# EAGLE design VisualEar-2.0 (EAGLE 9.6.2)
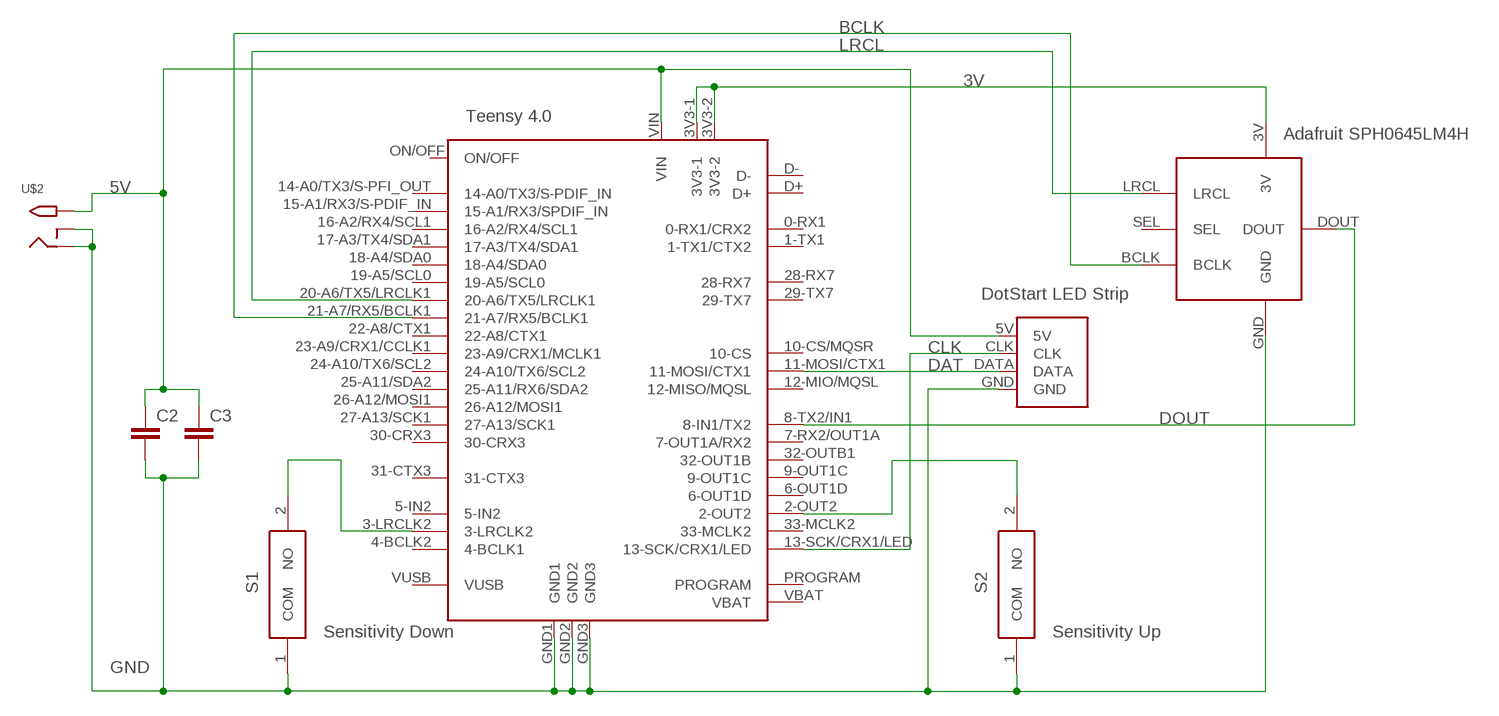
[diagram p0: schematic, sheet 1]

## Parts
C2  CAPPTH  [CAP-PTH-SMALL]
C3  CAPPTH  [CAP-PTH-SMALL]
S1  TACTILE-SWITCHTHRU-HOLE  [CLICK-WEL]
S2  TACTILE-SWITCHTHRU-HOLE  [CLICK-WEL]
U$1  TEENSY40DIP  [TEENSY40-DIP]
U$2  2.1MMJACKTHM  [PJ-102A]
U$3  AF-I2S-MIC  [AF-I2S-MIC]
U$4  LED-STRIP  [LED_STRIP]

## Nets
3V: U$1.3V3-1 U$1.3V3-2 U$3.3V
5V: C2.1 C3.1 U$1.VIN U$2.TIP U$4.5V
BCLK: U$1.21-A7/RX5/BCLK1 U$3.BCLK
CLK: U$1.13-SCK/CRX1/LED U$4.CLK
DAT: U$1.11-MOSI/CTX1 U$4.DATA
DOUT: U$1.8-TX2/IN1(8-IN1/TX2) U$3.DOUT
GND: C2.2 C3.2 S1.1(COM) S2.1(COM) U$1.GND1 U$1.GND2 U$1.GND3 U$2.RING U$2.RING_SW U$3.GND U$4.GND
LRCL: U$1.20-A6/TX5/LRCLK1 U$3.LRCL
N$1: S2.2(NO) U$1.2-OUT2
N$2: S1.2(NO) U$1.3-LRCLK2
Unconnected: U$1.0-RX1(0-RX1/CRX2) U$1.1-TX1(1-TX1/CTX2) U$1.4-BCLK2(4-BCLK1) U$1.5-IN2 U$1.6-OUT1D U$1.7-RX2/OUT1A(7-OUT1A/RX2) U$1.9-OUT1C U$1.10-CS/MQSR(10-CS) U$1.12-MIO/MQSL(12-MISO/MQSL) U$1.14-A0/TX3/S-PFI_OUT(14-A0/TX3/S-PDIF_IN) U$1.15-A1/RX3/S-PDIF_IN(15-A1/RX3/SPDIF_IN) U$1.16-A2/RX4/SCL1 U$1.17-A3/TX4/SDA1 U$1.18-A4/SDA0 U$1.19-A5/SCL0 U$1.22-A8/CTX1 U$1.23-A9/CRX1/CCLK1(23-A9/CRX1/MCLK1) U$1.24-A10/TX6/SCL2 U$1.25-A11/SDA2(25-A11/RX6/SDA2) U$1.26-A12/MOSI1 U$1.27-A13/SCK1 U$1.28-RX7 U$1.29-TX7 U$1.30-CRX3 U$1.31-CTX3 U$1.32-OUTB1(32-OUT1B) U$1.33-MCLK2 U$1.D+ U$1.D- U$1.ON/OFF U$1.PROGRAM U$1.VBAT U$1.VUSB U$3.SEL

## Notes on the sheet
- Teensy 4.0
- Adafruit SPH0645LM4H
- DotStart LED Strip
- Sensitivity Down | Sensitivity Up

## Library data of the parts
C2 C3 = philbot:CAP: Capacitor Standard 0603 ceramic capacitor, and 0.1" leaded capacitor.
S1 S2 = philbot:TACTILE-SWITCH: Tactile Switches Tact 50mA 12VDC, 6.0x3.5, 2.5mm H, 250gf, J leads, No ground pin, Red Actuator Source: Datasheet <https://www.mouser.com/datasheet/2/60/pts636-1550567.pdf>
U$1 = teensy:TEENSY40: Teensy 4.0 device including POGO pins for pins 24 - 33, but not yet pins for D+ and D-. Symbol layout is what works for me and may not suite everyone... that can be added or additional symbols can be created to be used in a modilied davie name.
U$2 = philbot:2.1MMJACK: 2.1mm x 5.5mm THM DC jack with internal switch. Digikey part #PJ-102A, 4UCON part #05537 2.1mm x 5.5mm SMT DC jack with internal switch. Digikey part #PJ-002A-SMT, 4UCON part #03267 By microbuilder.eu & adafruit.com
U$3 = philbot:AF-I2S-MIC
U$4 = philbot:LED-STRIP

## Board
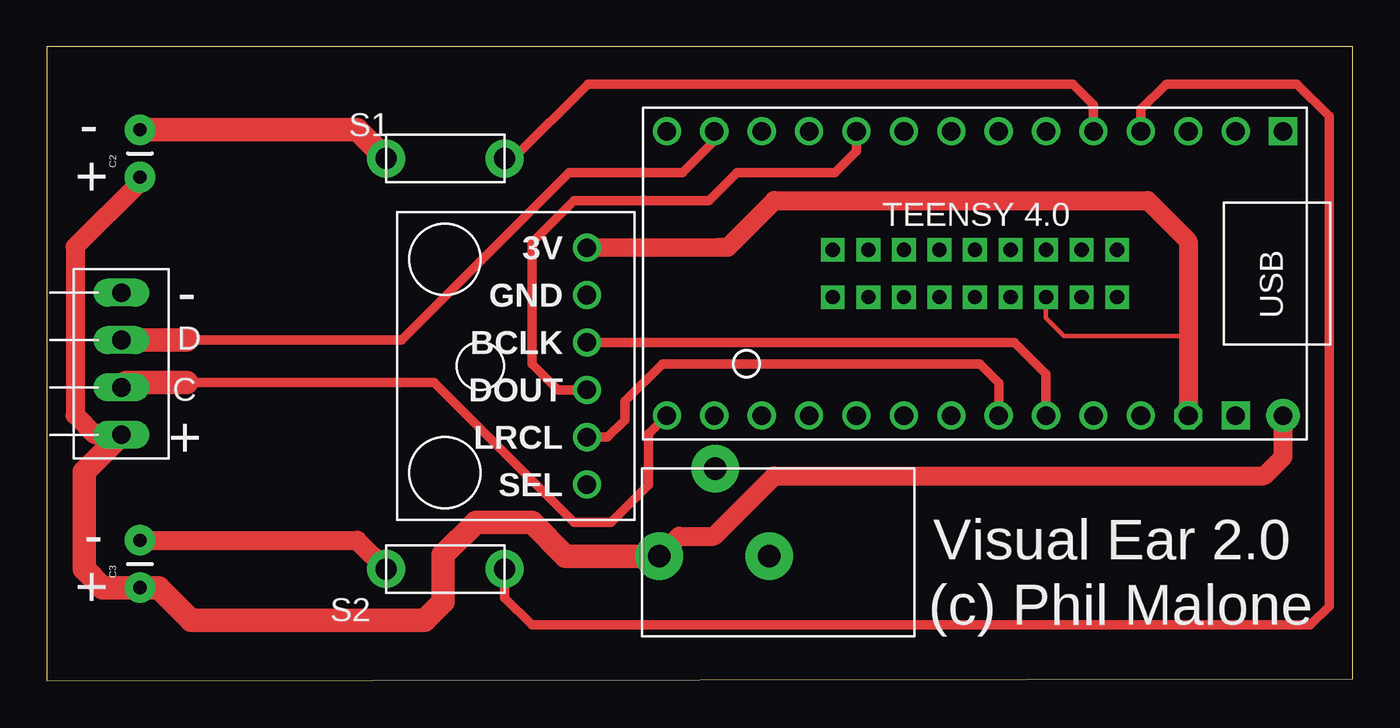
[diagram p1: board, top side]
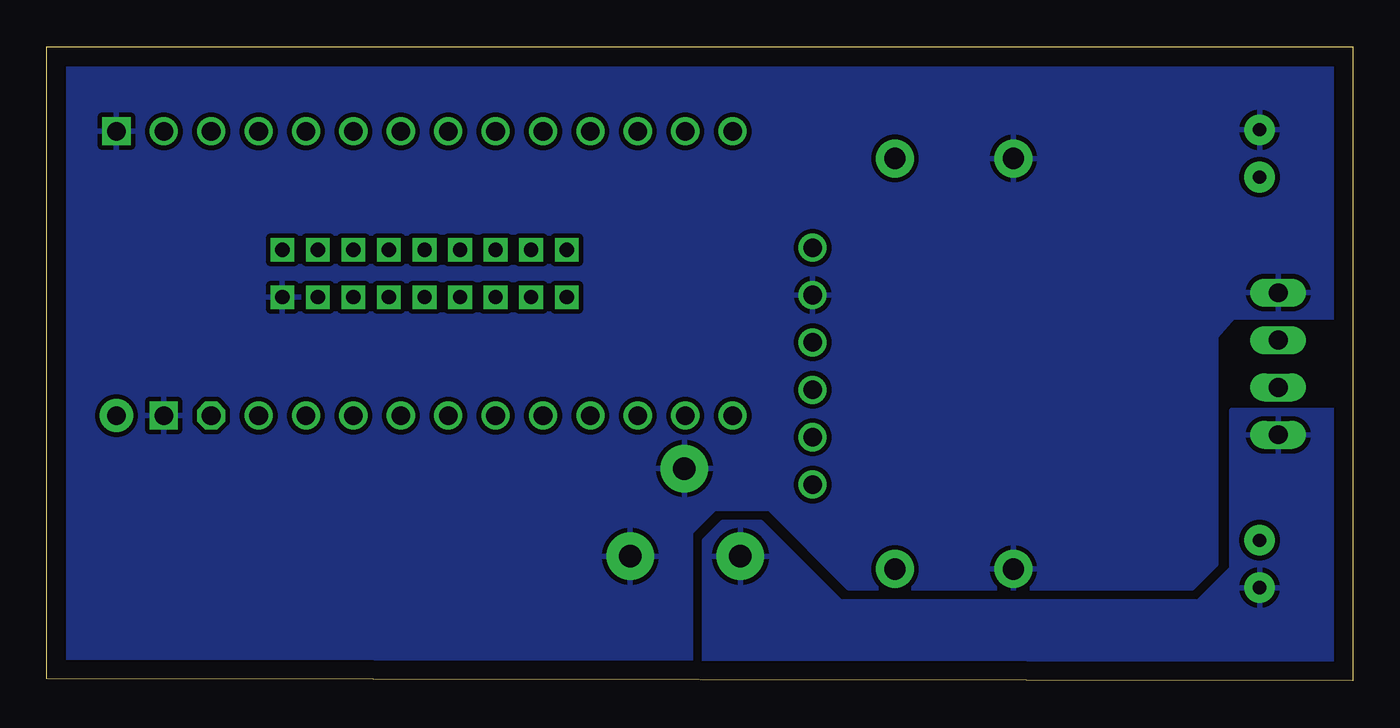
[diagram p2: board, bottom side, seen from below]

Size 70 x 34 mm. Coordinates in mm from the lower left corner, seen from the top.
Outline: 0,0 70,0.12 70,34 0,34 0,0
Copper layers (1*16): Top 0.035mm / dielectric 1.5mm / Bottom 0.035mm
Design rules "default": minimum track width 6mil, minimum drill 0.35mm, track to track 6mil, track to pad 6mil, pad to pad 6mil, via to via 6mil, smd to smd 6mil, copper to edge 40mil, drill to drill 6mil, minimum pad ring 10mil, minimum via ring 8mil, stop-mask expansion 4mil, vias tented up to drill 0mil, thermal gap 10mil

### Footprints (pad centres in the part's own frame; a part is rotated, then mirrored left to right if it is on the bottom)
CAP-PTH-SMALL = drill 0.7 pad 1.651: 1 0,0; 2 2.54,0
CLICK-WEL = drill 1.143 pad 2.032: 1 -3.81,0; 2 2.54,0
TEENSY40-DIP = drill 1: 0-RX1 -13.97,-7.62; 1-TX1 -11.43,-7.62; 2-OUT2 -8.89,-7.62; 3-LRCLK2 -6.35,-7.62; 4-BCLK2 -3.81,-7.62; 5-IN2 -1.27,-7.62; 6-OUT1D 1.27,-7.62; 7-RX2/OUT1A 3.81,-7.62; 8-TX2/IN1 6.35,-7.62; 9-OUT1C 8.89,-7.62; 10-CS/MQSR 11.43,-7.62; 11-MOSI/CTX1 13.97,-7.62; 12-MIO/MQSL 16.51,-7.62; 13-SCK/CRX1/LED 16.51,7.62; 14-A0/TX3/S-PFI_OUT 13.97,7.62; 15-A1/RX3/S-PDIF_IN 11.43,7.62; 16-A2/RX4/SCL1 8.89,7.62; 17-A3/TX4/SDA1 6.35,7.62; 18-A4/SDA0 3.81,7.62; 19-A5/SCL0 1.27,7.62; 20-A6/TX5/LRCLK1 -1.27,7.62; 21-A7/RX5/BCLK1 -3.81,7.62; 22-A8/CTX1 -6.35,7.62; 23-A9/CRX1/CCLK1 -8.89,7.62 | drill 1 octagon: 3V3-1 -11.43,7.62 | drill 0.762 pad 1.143 square: 3V3-2 -3.81,1.27; 24-A10/TX6/SCL2 5.715,1.27; 25-A11/SDA2 -3.81,-1.27; 26-A12/MOSI1 7.62,1.27; 27-A13/SCK1 -1.905,-1.27; 28-RX7 1.905,1.27; 29-TX7 0,-1.27; 30-CRX3 0,1.27; 31-CTX3 1.905,-1.27; 32-OUTB1 -1.905,1.27; 33-MCLK2 3.81,-1.27; D+ -7.62,-1.27; D- 3.81,1.27; GND2 -7.62,1.27; ON/OFF 5.715,-1.27; PROGRAM 7.62,-1.27; VBAT -5.715,1.27; VUSB -5.715,-1.27 | drill 1 square: GND1 -16.51,-7.62; GND3 -13.97,7.62 | drill 1 pad 1.778: VIN -16.51,7.62
PJ-102A = drill 1.2 pad 2.54: RING 0.1,-3.39; RING_SW -4.6,-6.29; TIP 0.1,-9.29
AF-I2S-MIC = drill 1: 3V 6.35,-3.81; BCLK 1.27,-3.81; DOUT -1.27,-3.81; GND 3.81,-3.81; LRCL -3.81,-3.81; SEL -6.35,-3.81
LED_STRIP = drill 1 long: 5V 0,3.81; CLK 0,1.27; DATA 0,-1.27; GND 0,-3.81

### Placement (x,y rotation side)
C2  5,27 90 top
C3  5,5 90 top
S1  22,28 0 top
S2  22,6 0 top
U$1  49.75,21.84 180 top
U$2  42.12,6.78 270 top
U$3  25.14,16.87 90 top
U$4  4,17 180 top

### Tracks (layer width: path | path; a pad name or v marks a point on that pad's centre or on a via)
3V
  Top 0.254: U$1.3V3-2 53.56,19.44 54.5,18.5 61.18,18.5
  Top 1.016: U$3.3V 36,23.25 36.5,23.25 39,25.75 59,25.75 61.18,23.57 61.18,18.5 U$1.3V3-1
5V
  Top 1.016: U$2.TIP 33.9,7.75 35.75,7.75 39,11 65.25,11 66.26,12.01 U$1.VIN | C2.1 5,26.75 1.52,23.27 1.52,14.25 2.58,13.19 U$4.5V
  Top 1.27: U$4.5V 2,11.19 2,6 3,5 C3.1 6,5 7.75,3.25 20.25,3.25 21.25,4.25 21.25,6.75 23,8.5 26,8.5 27.82,6.68 U$2.TIP
  pour Bottom (isolate 0.254): 31.75,8.5 33.75,8.5 34.75,7.5 34.75,1 1,1 1,14.5 6.5,14.5 6.5,6 8.25,4.25 27.5,4.25
BCLK
  Top 0.508: U$3.BCLK 51.86,18.14 53.56,16.44 U$1.21-A7/RX5/BCLK1
CLK
  Top 0.508: U$1.13-SCK/CRX1/LED 32.25,13.23 32.25,10.5 30.25,8.5 28.25,8.5 20.75,16 7.5,16
  Top 1.27: U$4.CLK 4.27,16 7.5,16
DAT
  Top 0.508: U$1.11-MOSI/CTX1 35.78,28.96 34.07,27.25 28,27.25 19.02,18.27 7.5,18.27
  Top 1.27: U$4.DATA 7.5,18.27
DOUT
  Top 0.508: U$3.DOUT 27.4,15.6 26,17 26,23.5 28.25,25.75 35.5,25.75 37,27.25 42.25,27.25 43.4,28.4 U$1.8-TX2/IN1
GND
  Top 1.016: C3.2 16.65,7.54 S2.1
  Top 1.27: C2.2 16.65,29.54 S1.1
  pour Bottom (isolate 0.254): 1,33 69,33 69,1 35.5,1 35.5,8 34.25,9.25 31.25,9.25 27,5 8.62,5 7.34,6.28 7.34,18.46 6.44,19.5 1,19.5
LRCL
  Top 0.508: U$3.LRCL 30.06,13.06 31,14 31,15 33,17 50,17 51.02,15.98 U$1.20-A6/TX5/LRCLK1
N$1
  Top 0.508: U$1.2-OUT2 58.64,30.64 60,32 67,32 68.73,30.27 68.73,4 67.73,3 26,3 24.54,4.46 S2.2
N$2
  Top 0.508: S1.2 25,28 29,32 55,32 56.1,30.9 U$1.3-LRCLK2

### Text on the board
tPlace: - | + | - | D | C | + | - | Visual Ear 2.0 | + | (c) Phil Malone